# Altium project JTAG-ADAPTOR.PrjPcb
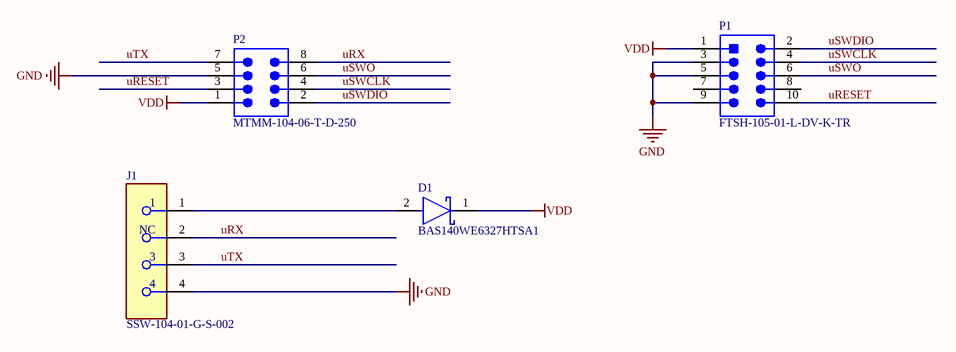
[diagram p0: JTAG-ADAPTOR.SchDoc]
1 sheet, 4 parts. Net scope: global (net labels, ports and power ports of the same name join across sheets).
Board file: JTAG-ADAPTOR.PcbDoc

## Sheet JTAG-ADAPTOR.SchDoc
size A

### Parts
D1  BAS140WE6327HTSA1  [FP-PG-SOD323-2-MFG]
J1  SSW-104-01-G-S-002  [FP-SSW-104-01-G-S-002-MFG]
P1  FTSH-105-01-L-DV-K-TR  [SMTC-FTSH-105-01-L-DV-K_V]
P2  MTMM-104-06-T-D-250  [SMTC-MTMM-104-06-X-D-250]

### Nets
GND: J1.4 P1.3 P1.5 P1.9 P2.5
VDD: D1.1(C) P1.1 P2.1
uRESET: P1.10 P2.3
uRX: J1.2(NC) P2.8
uSWCLK: P1.4 P2.4
uSWDIO: P1.2 P2.2
uSWO: P1.6 P2.6
uTX: J1.3 P2.7
NetD1_2: D1.2(A) J1.1

Not connected (* = marked no-connect by the designer): P1 7 8

### Library data of the parts
D1 = CMP-32890-000002-1: DIODE SCHOTTKY 40V 120MA SOD323; Peak Non-Repetitive Surge Current: 200mA; Forward Voltage: 1V; Reverse Recovery Time: 100ps; Element Configuration: Single; Min Operating Temperature: -55°C; Average Rectified Current: 120mA; Halogen Free: Not Halogen Free; Mount: Surface Mount; Max Reverse Voltage (DC): 40V; Case/Package: SOD-323-2; Packaging: Tape and Reel; Lead Free: Lead Free; Radiation Hardening: No; Number of Pins: 2; Forward Current: 120mA; Max Operating Temperature: 125°C; Max Repetitive Reverse Voltage (Vrrm): 40V
J1 = CMP-02766-000071-1: CONN RCPT 4POS 0.1 GOLD PCB; Manufacturer: Samtec; Pitch: 2.54mm; Is Female: yes; Conn Gender: Female; Conn Orientation: Vertical; Voltage Rating: 655V; Number Of Contacts: 4; Description: 4 Position Receptacle Connector Through Hole; Current Rating: 4.7A; Number Of Rows: 1; Package: HDR4; Contact Material: Gold,Nickel; Device Class L2: Headers and Wire Housings; Height: 8.64mm; ComponentLink2URL: http://suddendocs.samtec.com/catalog_english/ssw_th.pdf; RoHS: TRUE; Footprint Url: http://suddendocs.samtec.com/prints/ssw-s.pdf; Temperature Range Low: -55°C; ComponentLink2Description: Datasheet; Automotive: No; Digikey Description: CONN RCPT 4POS 0.1 GOLD PCB; Temperature Range High: +125°C; Lead Free: Yes; Device Class L3: unset; Octopart: https://octopart.com/ssw-104-01-g-s-002-samtec-17347181; Manufacturer Part Number: SSW-104-01-G-S-002; Device Class L1: Connectors; Temperature: -55°C to +125°C; Category: Conn
P1 = CMP-2000-06293-1: Male Header, Pitch 1.27 mm, 2 x 5 Position, Height 6.12 mm, -55 to 125 degC, RoHS, Tape and Reel; Manufacturer: SamtecInc.; Pitch: 1.27mm; Rad Hard: No; Gender: HDR; Number of Contacts: 10; Contact Plating: GoldOverNickel; Number of Rows: 2; Termination Method: Solder; Package Reference: FTSH-105-01-L-DV-K; Package Description: Male Header, Pitch 1.27 mm, 2 x 5 Position, Height 5.97 mm, Tail Length 4.32 mm; Category: ConnectorHeadersandPCBReceptacles; Mounting Technology: SurfaceMount; Type: UnshroudedHeader; Package URL: http://suddendocs.samtec.com/prints/ftsh-1xx-xx-xxx-dv-xxx-footprint.pdf; Datasheet Version: 09/2015; Datasheet URL: https://ciiva.com/datasheet-click-20089621?src=ciiva&sig=740d15a9; Manufacturer URL: http://www.samtec.com/
P2 = CMP-1029-00105-1: Modified Through-Hole Header, Vertical, -55 to 105 degC, 2 mm Pitch, 8-Pin, Male, RoHS; Manufacturer: Samtec; Pitch: 2 mm; ComponentLink1URL: http://www.samtec.com; ComponentLink2Description: Datasheet; PackageDescription: 2mm Terminal Strip Assembly; DatasheetVersion: F-214; PackageReference: MTMM-104-06-X-D-250; RoHS: True; Mounting Technology: Through-hole; PackageVersion: AE, 12/1993; PartNumber: MTMM-104-06-T-D-250; Orientation: Vertical; ComponentLink3URL: http://www.samtec.com/documents/webfiles/cpdf/MTMM-1XX-XX-XX-X-XXX-XX-XXX-MKT.pdf; ComponentLink2URL: http://d2a072wq521u33.cloudfront.net/catalog_english//MTMM_TH.PDF; ComponentLink3Description: Package Specification; Temperature Range: -55 to 105 degC; ComponentLink1Description: Manufacturer URL